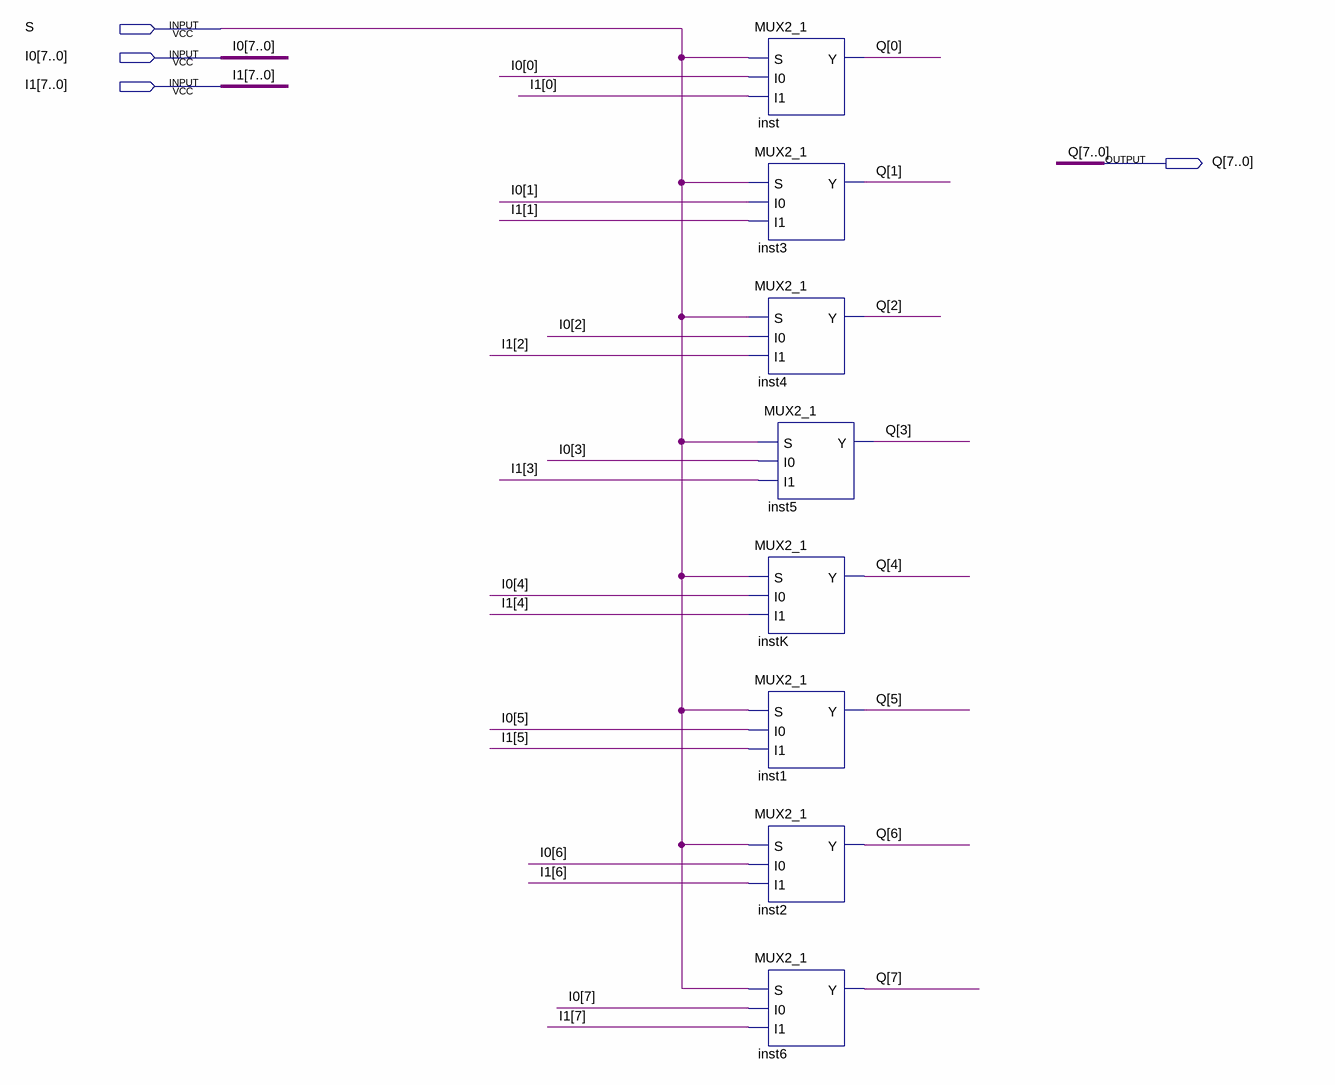
[diagram p0: schematic sheet]
// Quartus schematic SELECTOR_8BIT.bdf as structural Verilog: 8 symbols, 4 pins
module SELECTOR_8BIT (
  input  S,
  input  [7:0] I0,
  input  [7:0] I1,
  output [7:0] Q
);

  MUX2_1 inst (.S(S), .I0(I0[0]), .I1(I1[0]), .Y(Q[0]));
  MUX2_1 inst3 (.S(S), .I0(I0[1]), .I1(I1[1]), .Y(Q[1]));
  MUX2_1 inst4 (.S(S), .I0(I0[2]), .I1(I1[2]), .Y(Q[2]));
  MUX2_1 inst5 (.S(S), .I0(I0[3]), .I1(I1[3]), .Y(Q[3]));
  MUX2_1 instK (.S(S), .I0(I0[4]), .I1(I1[4]), .Y(Q[4]));
  MUX2_1 inst1 (.S(S), .I0(I0[5]), .I1(I1[5]), .Y(Q[5]));
  MUX2_1 inst2 (.S(S), .I0(I0[6]), .I1(I1[6]), .Y(Q[6]));
  MUX2_1 inst6 (.S(S), .I0(I0[7]), .I1(I1[7]), .Y(Q[7]));
endmodule
